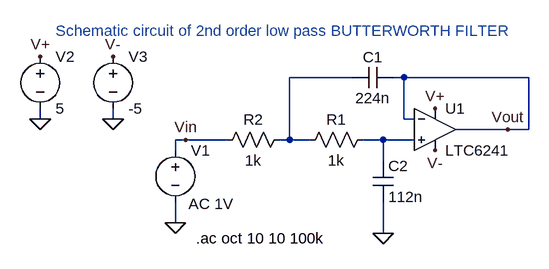
[diagram p0: schematic Butterworth.asc]
Butterworth.asc, the LTspice schematic file:
Version 4
SHEET 1 880 680
WIRE 224 64 128 64
WIRE 304 64 288 64
WIRE 496 64 304 64
WIRE -256 128 -256 112
WIRE -144 128 -144 112
WIRE 304 128 304 64
WIRE 320 128 304 128
WIRE 464 144 384 144
WIRE 496 144 496 64
WIRE 496 144 464 144
WIRE -32 160 -48 160
WIRE 32 160 -32 160
WIRE 128 160 128 64
WIRE 128 160 112 160
WIRE 160 160 128 160
WIRE 272 160 240 160
WIRE 320 160 272 160
WIRE -48 176 -48 160
WIRE 272 192 272 160
WIRE -48 288 -48 256
WIRE 272 304 272 256
FLAG -48 288 0
FLAG 272 304 0
FLAG 352 112 V+
FLAG -256 32 V+
FLAG -256 128 0
FLAG -144 128 0
FLAG -144 32 V-
FLAG 352 176 V-
FLAG -32 160 Vin
FLAG 464 144 Vout
SYMBOL Opamps\\LTC6241 352 144 R0
SYMATTR InstName U1
SYMBOL cap 224 80 R270
WINDOW 0 32 32 VTop 2
WINDOW 3 0 32 VBottom 2
SYMATTR InstName C1
SYMATTR Value 224n
SYMBOL res 256 144 R90
WINDOW 0 0 56 VBottom 2
WINDOW 3 32 56 VTop 2
SYMATTR InstName R1
SYMATTR Value 1k
SYMBOL res 128 144 R90
WINDOW 0 0 56 VBottom 2
WINDOW 3 32 56 VTop 2
SYMATTR InstName R2
SYMATTR Value 1k
SYMBOL cap 256 192 R0
SYMATTR InstName C2
SYMATTR Value 112n
SYMBOL voltage -48 160 R0
WINDOW 3 24 152 Left 2
WINDOW 123 20 99 Left 2
WINDOW 39 0 0 Left 2
SYMATTR Value ""
SYMATTR Value2 AC 1V
SYMATTR InstName V1
SYMBOL voltage -256 16 R0
SYMATTR InstName V2
SYMATTR Value 5
SYMBOL voltage -144 16 R0
SYMATTR InstName V3
SYMATTR Value -5
TEXT -232 -8 Left 2 ;Schematic circuit of 2nd order low pass BUTTERWORTH FILTER
TEXT -16 312 Left 2 !.ac oct 10 10 100k

The netlist it stands for:
* Butterworth.asc
XU1 N002 Vout V+ V- Vout LTC6241  ; pins In+ In- V+ V- OUT
C1 N001 Vout 224n
R1 N002 N001 1k
R2 N001 Vin 1k
C2 N002 0 112n
V1 Vin 0 AC 1V
V2 V+ 0 5
V3 V- 0 -5
* Schematic circuit of 2nd order low pass BUTTERWORTH FILTER
.ac oct 10 10 100k
.lib LTC4.lib
.backanno
.end